# Altium schematic sheet Module_BuckMini_MP2315GJ_5V.SchDoc
size A; SheetNumber: 1; SheetTotal: 1
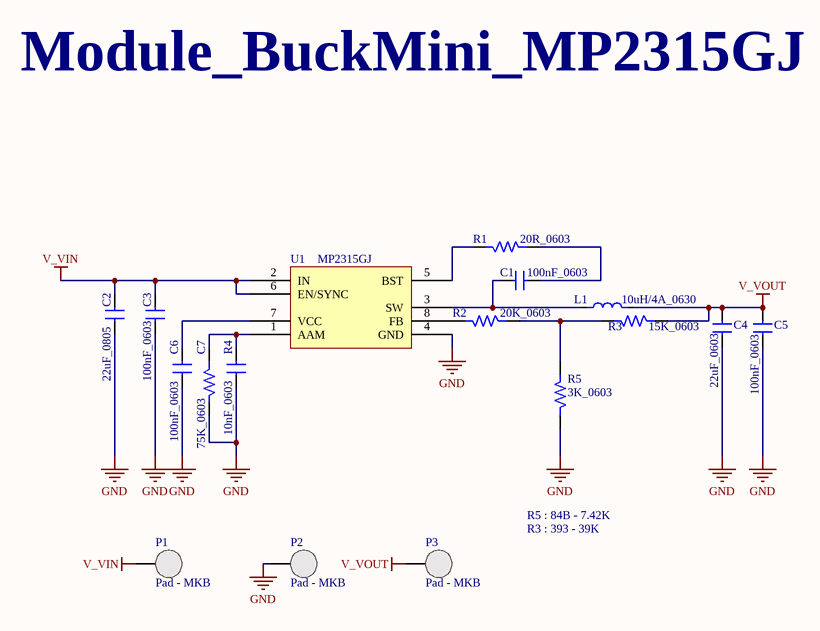
[diagram p0: Module_BuckMini_MP2315GJ_5V.SchDoc]

## Parts
C1  100nF_0603  [CN-SMD-0603]
C2  22uF_0805  [CN-SMD-0805 - H50]
C3  100nF_0603  [CN-SMD-0603]
C4  22uF_0603  [CN-SMD-0603]
C5  100nF_0603  [CN-SMD-0603]
C6  100nF_0603  [CN-SMD-0603]
C7  10nF_0603  [CN-SMD-0603]
L1  10uH/4A_0630  [INDUCTOR_0630]
P1  Pad - MKB  [Pad  - MKB 2x2.5 (mm)]
P2  Pad - MKB  [Pad  - MKB 2x2.5 (mm)]
P3  Pad - MKB  [Pad  - MKB 2x2.5 (mm)]
R1  20R_0603  [RES-SMD-0603]
R2  20K_0603  [RES-SMD-0603]
R3  15K_0603  [RES-SMD-0603]
R4  75K_0603  [RES-SMD-0603]
R5  3K_0603  [RES-SMD-0603]
U1  MP2315GJ  [TSOT-8]

## Nets
GND: C2.1 C3.1 C4.1 C5.1 C6.1 C7.1 P2.0(PAD) R4.1 R5.2 U1.4(GND)
V_VIN: C2.2 C3.2 P1.0(PAD) U1.2(IN) U1.6(EN/SYNC)
V_VOUT: C4.2 C5.2 L1.2 P3.0(PAD) R3.2
NetC1_1: C1.1 R1.2
NetC1_2: C1.2 L1.1 U1.3(SW)
NetC6_2: C6.2 U1.7(VCC)
NetC7_2: C7.2 R4.2 U1.1(AAM)
NetR1_1: R1.1 U1.5(BST)
NetR2_1: R2.1 U1.8(FB)
NetR2_2: R2.2 R3.1 R5.1

## Notes on the sheet
- Module_BuckMini_MP2315GJ
- R5 : 84B - 7.42K
- R3 : 393 - 39K

## Library data of the parts
C1 C3 C5 C6 = CAP 0603 104: Cap SMD, 0.06x0.03 inch, 1.55x0.85 mm - 1608
C2 = CAP 0805 226: Cap SMD, 0.08x0.05 inch, 2.0x1.2 mm - 2012
C4 = CAP 0603 226: Cap SMD, 0.06x0.03 inch, 1.55x0.85 mm - 1608
C7 = CAP 0603 103: Cap SMD, 0.06x0.03 inch, 1.55x0.85 mm - 1608
L1 = 0630 100: Inductor
R1 = RES 0603 20R: Resistor SMD, 0.06x0.03 inch, 1.55x0.85 mm - 1608, 1/10W
R2 = RES 0603 20K: Resistor SMD, 0.06x0.03 inch, 1.55x0.85 mm - 1608, 1/10W
R3 = RES 0603 15K: Resistor SMD, 0.06x0.03 inch, 1.55x0.85 mm - 1608, 1/10W
R4 = RES 0603 75K: Resistor SMD, 0.06x0.03 inch, 1.55x0.85 mm - 1608, 1/10W
R5 = RES 0603 3K: Resistor SMD, 0.06x0.03 inch, 1.55x0.85 mm - 1608, 1/10W
U1 = MP2315GJ: High Efficiency 3A, 24V, 500kHz / Synchronous Step Down Converter